# EAGLE schematic Controller PCB v1 (EAGLE 9.6.2)
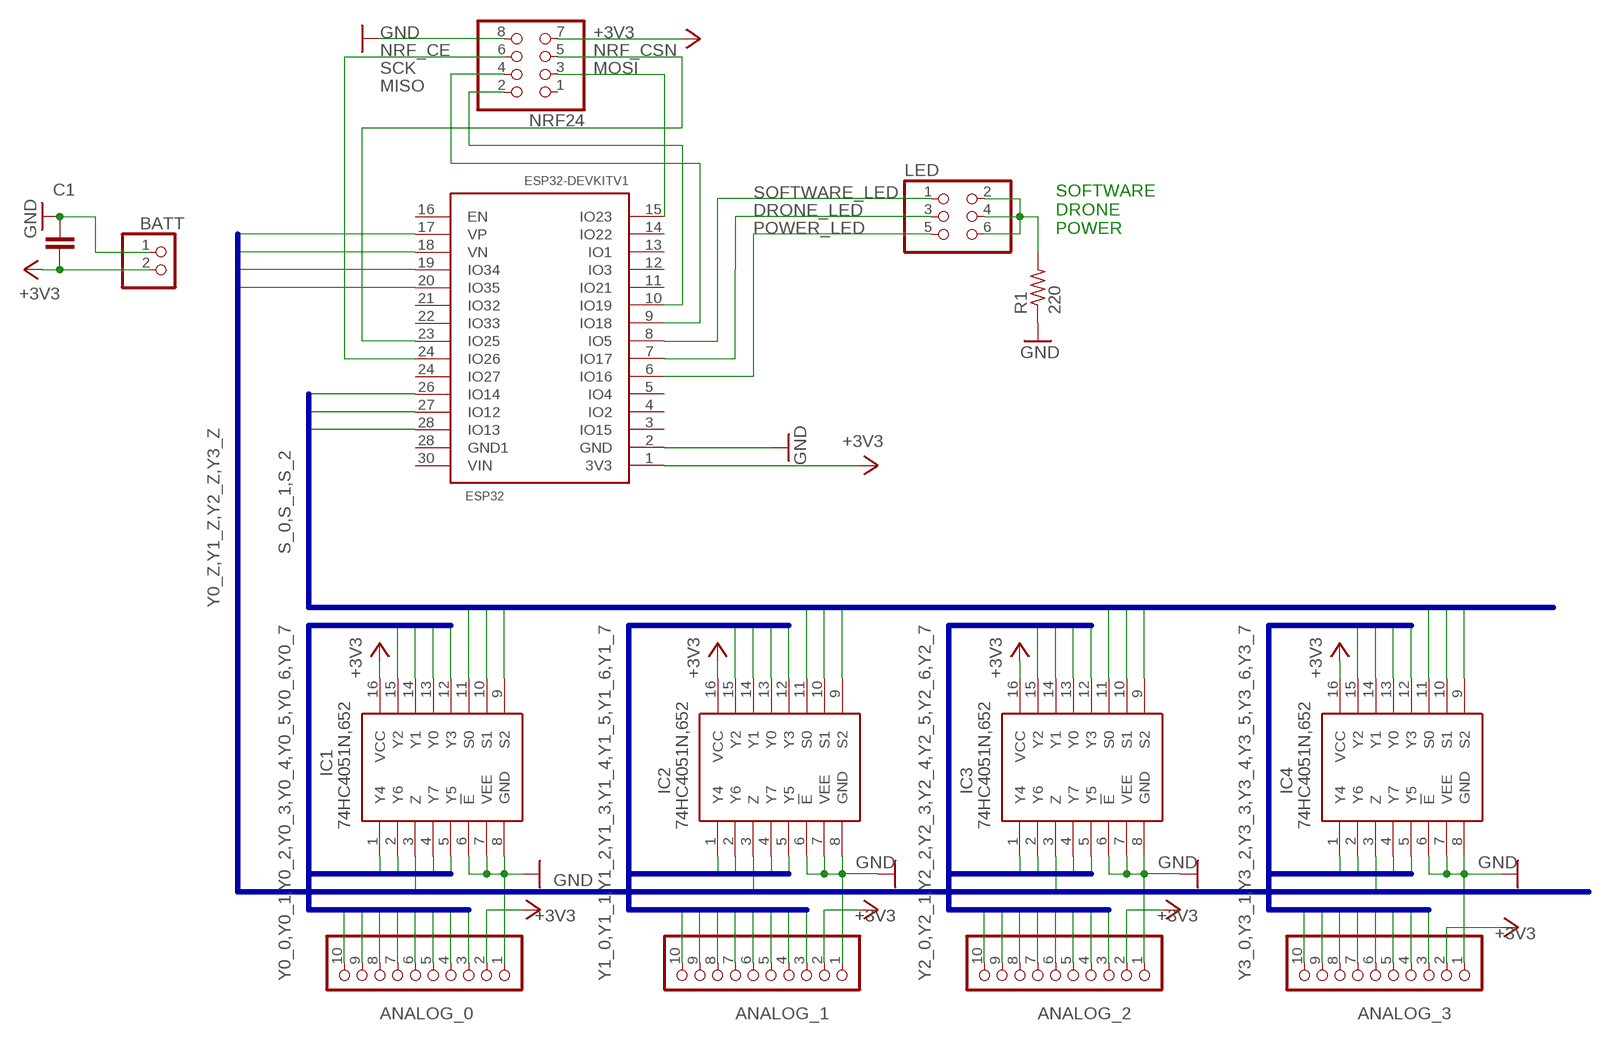
[diagram p0: schematic, sheet 1]

## Parts
ANALOG_0  PINHD-1X10/90  [1X10/90]
ANALOG_1  PINHD-1X10/90  [1X10/90]
ANALOG_2  PINHD-1X10/90  [1X10/90]
ANALOG_3  PINHD-1X10/90  [1X10/90]
BATT  PINHD-1X2  [1X02]
C1  C2.5/2  [C2.5-2]
ESP32  ESP32DEVKITV1  [ESP32-DEVKITV1]
IC1  74HC4051N,652  [DIP802W53P254L1902H420Q16N]
IC2  74HC4051N,652  [DIP802W53P254L1902H420Q16N]
IC3  74HC4051N,652  [DIP802W53P254L1902H420Q16N]
IC4  74HC4051N,652  [DIP802W53P254L1902H420Q16N]
LED  PINHD-2X3  [2X03]
NRF24  PINHD-2X4/90  [2X04/90]
R1  220  R-US_0204/7  [0204/7]

## Nets
+3V3: ANALOG_0.2 ANALOG_1.2 ANALOG_2.2 ANALOG_3.2 BATT.2 C1.2 ESP32.1(3V3) IC1.16(VCC) IC2.16(VCC) IC3.16(VCC) IC4.16(VCC) NRF24.7
DRONE_LED: ESP32.7(IO17) LED.3
GND: ANALOG_0.1 ANALOG_1.1 ANALOG_2.1 ANALOG_3.1 BATT.1 C1.1 ESP32.2(GND) IC1.6(!E) IC1.7(VEE) IC1.8(GND) IC2.6(!E) IC2.7(VEE) IC2.8(GND) IC3.6(!E) IC3.7(VEE) IC3.8(GND) IC4.6(!E) IC4.7(VEE) IC4.8(GND) NRF24.8 R1.1
MISO: ESP32.10(IO19) NRF24.2
MOSI: ESP32.15(IO23) NRF24.3
N$2: LED.2 LED.4 LED.6 R1.2
NRF_CE: ESP32.24(IO26) NRF24.6
NRF_CSN: ESP32.23(IO25) NRF24.5
POWER_LED: ESP32.6(IO16) LED.5
S_0: ESP32.28(IO13) IC1.11(S0) IC2.11(S0) IC3.11(S0) IC4.11(S0)
S_1: ESP32.27(IO12) IC1.10(S1) IC2.10(S1) IC3.10(S1) IC4.10(S1)
S_2: ESP32.26(IO14) IC1.9(S2) IC2.9(S2) IC3.9(S2) IC4.9(S2)
SCK: ESP32.9(IO18) NRF24.4
SOFTWARE_LED: ESP32.8(IO5) LED.1
Y0_0: ANALOG_0.3 IC1.13(Y0)
Y0_1: ANALOG_0.4 IC1.14(Y1)
Y0_2: ANALOG_0.5 IC1.15(Y2)
Y0_3: ANALOG_0.6 IC1.12(Y3)
Y0_4: ANALOG_0.7 IC1.1(Y4)
Y0_5: ANALOG_0.8 IC1.5(Y5)
Y0_6: ANALOG_0.9 IC1.2(Y6)
Y0_7: ANALOG_0.10 IC1.4(Y7)
Y0_Z: ESP32.17(VP) IC1.3(Z)
Y1_0: ANALOG_1.3 IC2.13(Y0)
Y1_1: ANALOG_1.4 IC2.14(Y1)
Y1_2: ANALOG_1.5 IC2.15(Y2)
Y1_3: ANALOG_1.6 IC2.12(Y3)
Y1_4: ANALOG_1.7 IC2.1(Y4)
Y1_5: ANALOG_1.8 IC2.5(Y5)
Y1_6: ANALOG_1.9 IC2.2(Y6)
Y1_7: ANALOG_1.10 IC2.4(Y7)
Y1_Z: ESP32.18(VN) IC2.3(Z)
Y2_0: ANALOG_2.3 IC3.13(Y0)
Y2_1: ANALOG_2.4 IC3.14(Y1)
Y2_2: ANALOG_2.5 IC3.15(Y2)
Y2_3: ANALOG_2.6 IC3.12(Y3)
Y2_4: ANALOG_2.7 IC3.1(Y4)
Y2_5: ANALOG_2.8 IC3.5(Y5)
Y2_6: ANALOG_2.9 IC3.2(Y6)
Y2_7: ANALOG_2.10 IC3.4(Y7)
Y2_Z: ESP32.19(IO34) IC3.3(Z)
Y3_0: ANALOG_3.3 IC4.13(Y0)
Y3_1: ANALOG_3.4 IC4.14(Y1)
Y3_2: ANALOG_3.5 IC4.15(Y2)
Y3_3: ANALOG_3.6 IC4.12(Y3)
Y3_4: ANALOG_3.7 IC4.1(Y4)
Y3_5: ANALOG_3.8 IC4.5(Y5)
Y3_6: ANALOG_3.9 IC4.2(Y6)
Y3_7: ANALOG_3.10 IC4.4(Y7)
Y3_Z: ESP32.20(IO35) IC4.3(Z)
Unconnected: ESP32.3(IO15) ESP32.4(IO2) ESP32.5(IO4) ESP32.11(IO21) ESP32.12(IO3) ESP32.13(IO1) ESP32.14(IO22) ESP32.16(EN) ESP32.21(IO32) ESP32.22(IO33) ESP32.24(IO27) ESP32.28(GND1) ESP32.30(VIN) NRF24.1

## Buses
Y0_0,Y0_1,Y0_2,Y0_3,Y0_4,Y0_5,Y0_6,Y0_7
Y1_0,Y1_1,Y1_2,Y1_3,Y1_4,Y1_5,Y1_6,Y1_7
Y0_Z,Y1_Z,Y2_Z,Y3_Z
S_0,S_1,S_2
Y2_0,Y2_1,Y2_2,Y2_3,Y2_4,Y2_5,Y2_6,Y2_7
Y3_0,Y3_1,Y3_2,Y3_3,Y3_4,Y3_5,Y3_6,Y3_7

## Notes on the sheet
- SOFTWARE
  DRONE
  POWER

## Library data of the parts
ANALOG_0 ANALOG_1-ANALOG_3 = pinhead:PINHD-1X10: PIN HEADER
BATT = pinhead:PINHD-1X2: PIN HEADER
C1 = capacitor-wima:C: CAPACITOR naming: grid - package width
ESP32 = ESP32-DEVKITV1:ESP32DEVKITV1
IC1-IC4 = 74HC4051N_652:74HC4051N,652: 8-channel analog multiplexer/demultiplexer Source: Datasheet <http://media.digikey.com/pdf/Data Sheets/NXP PDFs/74HC(T)4051_Rev_Feb2017.pdf>; DESCRIPTION: 8-channel analog multiplexer/demultiplexer; HEIGHT: 4.2mm; MANUFACTURER_NAME: Nexperia; MANUFACTURER_PART_NUMBER: 74HC4051N,652
LED = pinhead:PINHD-2X3: PIN HEADER
NRF24 = pinhead:PINHD-2X4: PIN HEADER
R1 = rcl:R-US_: RESISTOR, American symbol; SPICEPREFIX: R